# Altium project ePaper_Display.PrjPcb
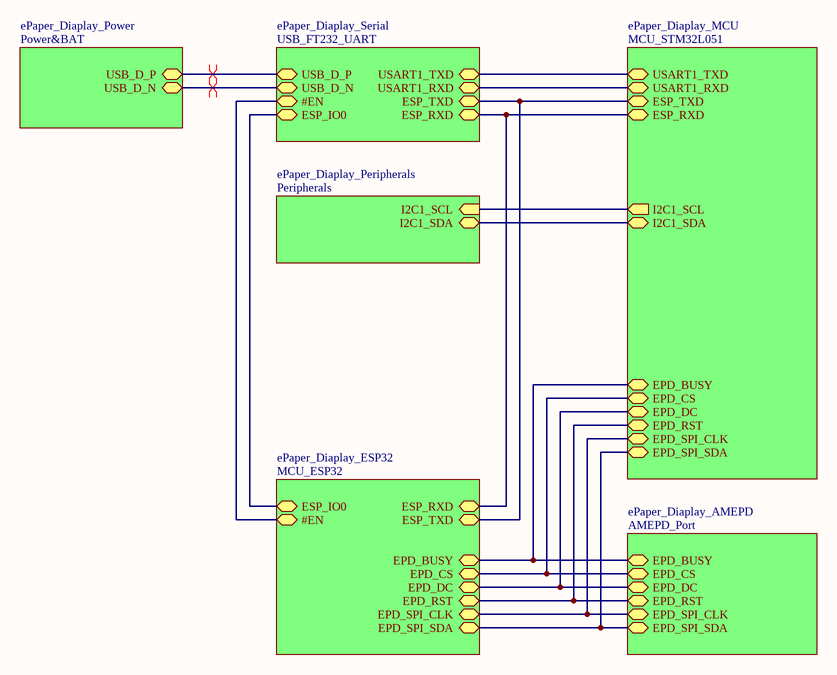
[diagram p0: ePaper_Display_Top.SchDoc]
7 sheets, 123 parts. Net scope: hierarchical (ports join the sheet entries above them; power ports are global).
Board file: ePpaer_Display_V1.0.PcbDoc
Sheets:
  ePaper_Display_Top.SchDoc
    ePaper_Diaplay_Power = Power&BAT.SchDoc
    ePaper_Diaplay_MCU = MCU_STM32L051.SchDoc
    ePaper_Diaplay_Peripherals = Peripherals.SchDoc
    ePaper_Diaplay_Serial = USB_FT232_UART.SchDoc
    ePaper_Diaplay_ESP32 = MCU_ESP32.SchDoc
    ePaper_Diaplay_AMEPD = AMEPD_Port.SchDoc

## Sheet ePaper_Display_Top.SchDoc
size A4; SheetNumber: 1; SheetTotal: 7

### Sub-sheets
ePaper_Diaplay_AMEPD = AMEPD_Port: EPD_BUSY (bidir), EPD_CS (bidir), EPD_DC (bidir), EPD_RST (bidir), EPD_SPI_CLK (bidir), EPD_SPI_SDA (bidir)
ePaper_Diaplay_ESP32 = MCU_ESP32: #EN (bidir), ESP_IO0 (bidir), ESP_RXD (bidir), ESP_TXD (bidir), EPD_SPI_SDA (bidir), EPD_SPI_CLK (bidir), EPD_RST (bidir), EPD_DC (bidir), EPD_CS (bidir), EPD_BUSY (bidir)
ePaper_Diaplay_MCU = MCU_STM32L051: I2C1_SCL (out), I2C1_SDA (bidir), USART1_TXD (bidir), USART1_RXD (bidir), ESP_TXD (bidir), ESP_RXD (bidir), EPD_DC (bidir), EPD_BUSY (bidir), EPD_CS (bidir), EPD_RST (bidir), EPD_SPI_CLK (bidir), EPD_SPI_SDA (bidir)
ePaper_Diaplay_Peripherals = Peripherals: I2C1_SDA (bidir), I2C1_SCL (in)
ePaper_Diaplay_Power = Power&BAT: USB_D_P (bidir), USB_D_N (bidir)
ePaper_Diaplay_Serial = USB_FT232_UART: USB_D_N (bidir), USB_D_P (bidir), USART1_RXD (bidir), USART1_TXD (bidir), #EN (bidir), ESP_IO0 (bidir), ESP_TXD (bidir), ESP_RXD (bidir)

### Nets
#EN: sheet ePaper_Diaplay_Serial/#EN, sheet ePaper_Diaplay_ESP32/#EN
EPD_BUSY: sheet ePaper_Diaplay_MCU/EPD_BUSY, sheet ePaper_Diaplay_ESP32/EPD_BUSY, sheet ePaper_Diaplay_AMEPD/EPD_BUSY
EPD_CS: sheet ePaper_Diaplay_MCU/EPD_CS, sheet ePaper_Diaplay_ESP32/EPD_CS, sheet ePaper_Diaplay_AMEPD/EPD_CS
EPD_DC: sheet ePaper_Diaplay_MCU/EPD_DC, sheet ePaper_Diaplay_ESP32/EPD_DC, sheet ePaper_Diaplay_AMEPD/EPD_DC
EPD_RST: sheet ePaper_Diaplay_MCU/EPD_RST, sheet ePaper_Diaplay_ESP32/EPD_RST, sheet ePaper_Diaplay_AMEPD/EPD_RST
EPD_SPI_CLK: sheet ePaper_Diaplay_MCU/EPD_SPI_CLK, sheet ePaper_Diaplay_ESP32/EPD_SPI_CLK, sheet ePaper_Diaplay_AMEPD/EPD_SPI_CLK
EPD_SPI_SDA: sheet ePaper_Diaplay_MCU/EPD_SPI_SDA, sheet ePaper_Diaplay_ESP32/EPD_SPI_SDA, sheet ePaper_Diaplay_AMEPD/EPD_SPI_SDA
ESP_IO0: sheet ePaper_Diaplay_Serial/ESP_IO0, sheet ePaper_Diaplay_ESP32/ESP_IO0
ESP_RXD: sheet ePaper_Diaplay_MCU/ESP_RXD, sheet ePaper_Diaplay_Serial/ESP_RXD, sheet ePaper_Diaplay_ESP32/ESP_RXD
ESP_TXD: sheet ePaper_Diaplay_MCU/ESP_TXD, sheet ePaper_Diaplay_Serial/ESP_TXD, sheet ePaper_Diaplay_ESP32/ESP_TXD
I2C1_SCL: sheet ePaper_Diaplay_MCU/I2C1_SCL, sheet ePaper_Diaplay_Peripherals/I2C1_SCL
I2C1_SDA: sheet ePaper_Diaplay_MCU/I2C1_SDA, sheet ePaper_Diaplay_Peripherals/I2C1_SDA
USART1_RXD: sheet ePaper_Diaplay_MCU/USART1_RXD, sheet ePaper_Diaplay_Serial/USART1_RXD
USART1_TXD: sheet ePaper_Diaplay_MCU/USART1_TXD, sheet ePaper_Diaplay_Serial/USART1_TXD
USB_D_N: sheet ePaper_Diaplay_Power/USB_D_N, sheet ePaper_Diaplay_Serial/USB_D_N
USB_D_P: sheet ePaper_Diaplay_Power/USB_D_P, sheet ePaper_Diaplay_Serial/USB_D_P

### Layout directives
differential pair: USB_D_N, USB_D_P

### Notes on the sheet
- Date:
- Size:
- Project Title:
- A4
- Revision:
- Sheet:
- of:
- File:
- Author:
- Chenhui Zhao

## Sheet Power&BAT.SchDoc
size A4; SheetNumber: 2; SheetTotal: 6
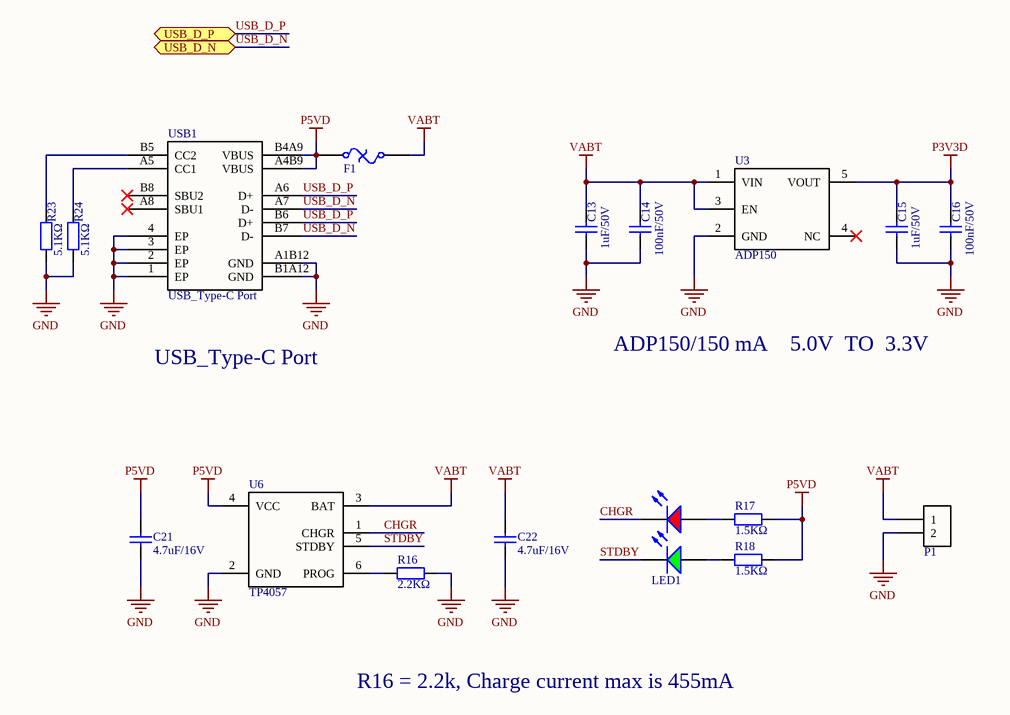
[diagram p1: Power&BAT.SchDoc]

### Parts
C13  1uF/50V  [0603_C]
C14  100nF/50V  [0603_C]
C15  1uF/50V  [0603_C]
C16  100nF/50V  [0603_C]
C21  4.7uF/16V  [0603_C]
C22  4.7uF/16V  [0603_C]
F1  500mA  [F1206]  (value not drawn)
LED1  LTST-C195TGKRKT  [LED_SMD]  (value not drawn)
P1  Header 2  [1.25_SMD]  (value not drawn)
R16  2.2KΩ  [0402_R]
R17  1.5KΩ  [0402_R]
R18  1.5KΩ  [0402_R]
R23  5.1KΩ  [0402_R]
R24  5.1KΩ  [0402_R]
U3  ADP150  [SOT23-5]
U6  TP4057  [SOT23-6]
USB1  USB_Type-C Port  [USB Type C Port (SMD)_16Pin]

### Ports
USB_D_N (bidir), USB_D_P (bidir)

### Nets
GND: C13.1 C14.1 C15.1 C16.1 C21.1 C22.1 P1.2 R16.2 R23.1 R24.1 U3.2(GND) U6.2(GND) USB1.1(EP) USB1.2(EP) USB1.3(EP) USB1.4(EP) USB1.A1B12(GND) USB1.B1A12(GND)
P3V3D: C15.2 C16.2 U3.5(VOUT)
P5VD: C21.2 F1.1 R17.2 R18.2 U6.4(VCC) USB1.A4B9(VBUS) USB1.B4A9(VBUS)
VABT: C13.2 C14.2 C22.2 F1.2 P1.1 U3.1(VIN) U3.3(EN) U6.3(BAT)
CHGR: LED1.4 U6.1(CHGR)
STDBY: LED1.3 U6.5(STDBY)
USB_D_N: USB1.A7(D-) USB1.B7(D-) ; port USB_D_N
USB_D_P: USB1.A6(D+) USB1.B6(D+) ; port USB_D_P
NetLED1_1: LED1.1 R18.1
NetLED1_2: LED1.2 R17.1
NetR16_1: R16.1 U6.6(PROG)
NetR23_2: R23.2 USB1.B5(CC2)
NetR24_2: R24.2 USB1.A5(CC1)

Not connected (* = marked no-connect by the designer): U3 4(NC)*; USB1 A8(SBU1)* B8(SBU2)*

### Notes on the sheet
- USB_Type-C Port
- ADP150/150 mA    5.0V  TO  3.3V
- R16 = 2.2k, Charge current max is 455mA
- Date:
- Size:
- Project Title:
- A4
- Revision:
- Sheet:
- of:
- File:
- Author:
- Chenhui Zhao

### Library data of the parts
C13 C15 = 0603 1uF (105) 10% 50V: 贴片电容; ComponentLink1Description: 供应商链接; ComponentLink1URL: http://www.szlcsc.com/product/details_16531.html; Package: 0603; Supplier: LC; SuppliersPartNumber: C15849
C14 C16 = 0603 100nF (104) 10% 50V: 贴片电容; ComponentLink1Description: 供应商链接; ComponentLink1URL: http://www.szlcsc.com/product/details_15331.html; Package: 0603; Supplier: LC; SuppliersPartNumber: C14663
C21 C22 = 0603 4.7uF (475) 10% 16V: 贴片电容; ComponentLink1Description: 供应商链接; ComponentLink1URL: http://www.szlcsc.com/product/details_20375.html; Package: 0603; Supplier: LC; SuppliersPartNumber: C19666
F1 = Fuse
LED1 = LED_SMD
P1 = Header 2: Header, 2-Pin
R16 = 0402 2.2KΩ (2201) 1%: 贴片电阻; ComponentLink1Description: 供应商链接; ComponentLink1URL: http://www.szlcsc.com/product/details_26622.html; Package: 0402; Supplier: LC; SuppliersPartNumber: C25879
R17 R18 = 0402 1.5KΩ (1501) 1%: 贴片电阻; ComponentLink1Description: 供应商链接; ComponentLink1URL: http://www.szlcsc.com/product/details_26610.html; Package: 0402; Supplier: LC; SuppliersPartNumber: C25867
R23 R24 = 0402 5.1KΩ (5101) 1%: 贴片电阻; ComponentLink1Description: 供应商链接; ComponentLink1URL: http://www.szlcsc.com/product/details_26648.html; Package: 0402; Supplier: LC; SuppliersPartNumber: C25905
U3 = ADP150: Ultralow Noise, 150 mA CMOS Linear Regulator
U6 = TP4057: 500mA线性锂离子电池充电器

## Sheet MCU_STM32L051.SchDoc
size A4; SheetNumber: 3; SheetTotal: 7
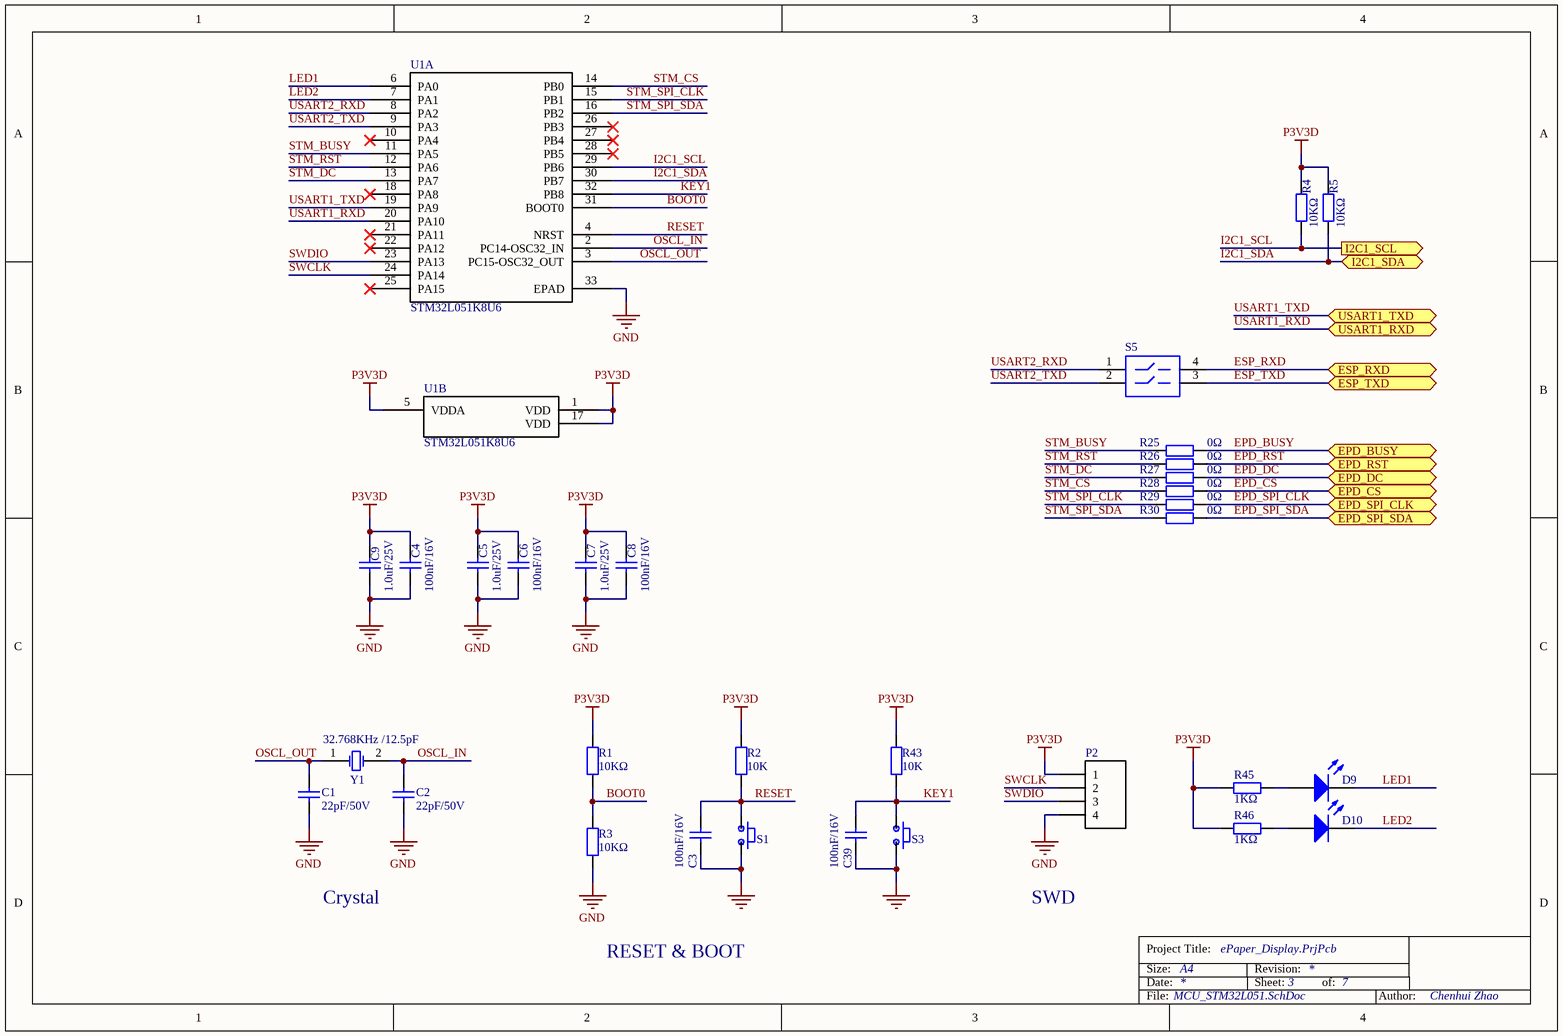
[diagram p2: MCU_STM32L051.SchDoc]

### Parts
C1  22pF/50V  [0402_C]
C2  22pF/50V  [0402_C]
C3  100nF/16V  [0402_C]
C4  100nF/16V  [0402_C]
C5  1.0uF/25V  [0402_C]
C6  100nF/16V  [0402_C]
C7  1.0uF/25V  [0402_C]
C8  100nF/16V  [0402_C]
C9  1.0uF/25V  [0402_C]
C39  100nF/16V  [0402_C]
D9  蓝灯 0603  [0603_LED_S1]  (value not drawn)
D10  蓝灯 0603  [0603_LED_S1]  (value not drawn)
P2  Header 4  [DIP4-2.00]  (value not drawn)
R1  10KΩ  [0402_R]
R2  10K  [0402_R]
R3  10KΩ  [0402_R]
R4  10KΩ  [0402_R]
R5  10KΩ  [0402_R]
R25  0Ω  [0402_R]
R26  0Ω  [0402_R]
R27  0Ω  [0402_R]
R28  0Ω  [0402_R]
R29  0Ω  [0402_R]
R30  0Ω  [0402_R]
R43  10K  [0402_R]
R45  1KΩ  [0402_R]
R46  1KΩ  [0402_R]
S1  Button  [SKRKAHE020]  (value not drawn)
S3  Button  [SKRKAHE020]  (value not drawn)
S5  拨码开关  [SW_SMT4]  (value not drawn)
U1  STM32L051K8U6  [UFQFPN32-5x5mm]  (parts A,B of 2)
Y1  32.768KHz /12.5pF  [SMD-3215_2P FC - 135]

### Ports
EPD_BUSY (bidir), EPD_CS (bidir), EPD_DC (bidir), EPD_RST (bidir), EPD_SPI_CLK (bidir), EPD_SPI_SDA (bidir), ESP_RXD (bidir), ESP_TXD (bidir), I2C1_SCL (out), I2C1_SDA (bidir), USART1_RXD (bidir), USART1_TXD (bidir)

### Nets
GND: C1.1 C2.1 C3.1 C4.1 C5.1 C6.1 C7.1 C8.1 C9.1 C39.1 P2.4 R3.1 S1.2 S3.2 U1.33(EPAD)
P3V3D: C4.2 C5.2 C6.2 C7.2 C8.2 C9.2 P2.1 R1.2 R2.2 R4.2 R5.2 R43.2 R45.2 R46.2 U1.1(VDD) U1.5(VDDA) U1.17(VDD)
BOOT0: R1.1 R3.2 U1.31(BOOT0)
EPD_BUSY: R25.2 ; port EPD_BUSY
EPD_CS: R28.2 ; port EPD_CS
EPD_DC: R27.2 ; port EPD_DC
EPD_RST: R26.2 ; port EPD_RST
EPD_SPI_CLK: R29.2 ; port EPD_SPI_CLK
EPD_SPI_SDA: R30.2 ; port EPD_SPI_SDA
ESP_RXD: S5.4 ; port ESP_RXD
ESP_TXD: S5.3 ; port ESP_TXD
I2C1_SCL: R4.1 U1.29(PB6) ; port I2C1_SCL
I2C1_SDA: R5.1 U1.30(PB7) ; port I2C1_SDA
KEY1: C39.2 R43.1 S3.1 U1.32(PB8)
LED1: D9.K U1.6(PA0)
LED2: D10.K U1.7(PA1)
OSCL_IN: C2.2 U1.2(PC14-OSC32_IN) Y1.2(OSC2)
OSCL_OUT: C1.2 U1.3(PC15-OSC32_OUT) Y1.1(OSC1)
RESET: C3.2 R2.1 S1.1 U1.4(NRST)
STM_BUSY: R25.1 U1.11(PA5)
STM_CS: R28.1 U1.14(PB0)
STM_DC: R27.1 U1.13(PA7)
STM_RST: R26.1 U1.12(PA6)
STM_SPI_CLK: R29.1 U1.15(PB1)
STM_SPI_SDA: R30.1 U1.16(PB2)
SWCLK: P2.2 U1.24(PA14)
SWDIO: P2.3 U1.23(PA13)
USART1_RXD: U1.20(PA10) ; port USART1_RXD
USART1_TXD: U1.19(PA9) ; port USART1_TXD
USART2_RXD: S5.1 U1.8(PA2)
USART2_TXD: S5.2 U1.9(PA3)
NetD9_A: D9.A R45.1
NetD10_A: D10.A R46.1

Not connected (* = marked no-connect by the designer): U1 10(PA4)* 18(PA8)* 21(PA11)* 22(PA12)* 25(PA15)* 26(PB3)* 27(PB4)* 28(PB5)*

### Notes on the sheet
- Crystal
- SWD
- RESET & BOOT
- Date:
- Size:
- Project Title:
- A4
- Revision:
- Sheet:
- of:
- File:
- Author:
- Chenhui Zhao

### Library data of the parts
C1 C2 = 0402 22pF (220) 5% 50V: 贴片电容; ComponentLink1Description: 供应商链接; ComponentLink1URL: http://www.szlcsc.com/product/details_1907.html; Package: 0402; Supplier: LC; SuppliersPartNumber: C1555
C3 C4 C6 C8 C39 = 0402 100nF (104) 10% 16V: 贴片电容; ComponentLink1Description: 供应商链接; ComponentLink1URL: http://www.szlcsc.com/product/details_1877.html; Package: 0402; Supplier: LC; SuppliersPartNumber: C1525
C5 C7 C9 = 0402 1.0uF (105) 10% 25V: 贴片电容; ComponentLink1Description: 供应商链接; ComponentLink1URL: http://www.szlcsc.com/product/details_53938.html; Package: 0402; Supplier: LC; SuppliersPartNumber: C52923
D9 D10 = 0603 蓝灯: 发光二极管; ComponentLink1Description: 供应商链接; ComponentLink1URL: http://www.szlcsc.com/product/details_73150.html; Package: 0603; Supplier: LC; SuppliersPartNumber: C72041
P2 = Header 4: Header, 4-Pin; LatestRevisionDate: 17-Jul-2002; LatestRevisionNote: Re-released for DXP Platform.; Publisher: Altium Limited
R1-R5 R43 = 0402 10KΩ (1002) 1%: 贴片电阻; ComponentLink1Description: 供应商链接; ComponentLink1URL: http://www.szlcsc.com/product/details_26487.html; Package: 0402; Supplier: LC; SuppliersPartNumber: C25744
R25-R30 = 0402 0Ω (0R0) 1%: 贴片电阻; ComponentLink1Description: 供应商链接; ComponentLink1URL: http://www.szlcsc.com/product/details_17853.html; Package: 0402; Supplier: LC; SuppliersPartNumber: C17168
R45 R46 = 0402 1KΩ (1001) 1%: 贴片电阻; ComponentLink1Description: 供应商链接; ComponentLink1URL: http://www.szlcsc.com/product/details_12256.html; Package: 0402; Supplier: LC; SuppliersPartNumber: C11702
S5 = SW-SMT2: SMT Switch, 4 Position, SPST
U1 = STM32L051K8U6: Ultra-low-power Arm Cortex-M0+ MCU with 64 Kbytes of Flash memory, 32 MHz CPU; Vendor: STMicroelectronics; Built_By: EMA_UL_Team; SourceLibrary: Updates_to_database_2020-10-19; Manufacturer_Part_Number: STM32L051K8U6; Copyright: Copyright (C) 2018 Accelerated Designs. All rights reserved; RefDes: RefDes; Type: DEV
Y1 = SMD-3215_2P 32.768KHz 20ppm 12.5pF: 贴片晶振; ComponentLink1Description: 供应商链接; ComponentLink1URL: http://www.szlcsc.com/product/details_33310.html; Package: SMD-3215_2P; Supplier: LC; SuppliersPartNumber: C32346

## Sheet Peripherals.SchDoc
size A4; SheetNumber: 4; SheetTotal: 7
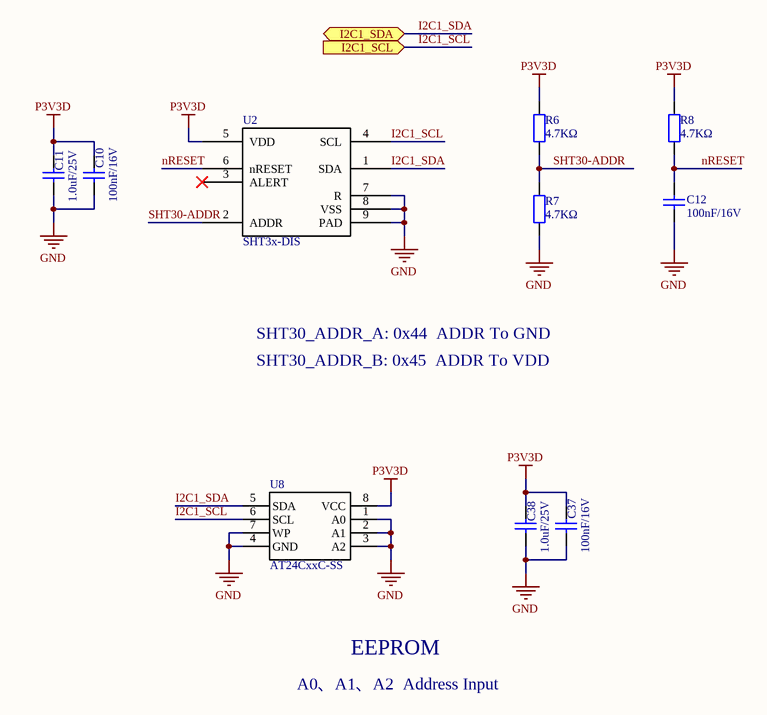
[diagram p3: Peripherals.SchDoc]

### Parts
C10  100nF/16V  [0402_C]
C11  1.0uF/25V  [0402_C]
C12  100nF/16V  [0402_C]
C37  100nF/16V  [0402_C]
C38  1.0uF/25V  [0402_C]
R6  4.7KΩ  [0402_R]
R7  4.7KΩ  [0402_R]
R8  4.7KΩ  [0402_R]
U2  SHT3x-DIS  [SHT3x-DIS_SEN]
U8  AT24CxxC-SS  [SOIC-8-39mm]

### Ports
I2C1_SCL (in), I2C1_SDA (bidir)

### Nets
GND: C10.1 C11.1 C12.1 C37.1 C38.1 R7.1 U2.7(R) U2.8(VSS) U2.9(PAD) U8.1(A0) U8.2(A1) U8.3(A2) U8.4(GND) U8.7(WP)
P3V3D: C10.2 C11.2 C37.2 C38.2 R6.2 R8.2 U2.5(VDD) U8.8(VCC)
I2C1_SCL: U2.4(SCL) U8.6(SCL) ; port I2C1_SCL
I2C1_SDA: U2.1(SDA) U8.5(SDA) ; port I2C1_SDA
nRESET: C12.2 R8.1 U2.6(nRESET)
SHT30-ADDR: R6.1 R7.2 U2.2(ADDR)

Not connected (* = marked no-connect by the designer): U2 3(ALERT)*

### Notes on the sheet
- SHT30_ADDR_A: 0x44  ADDR To GND
- SHT30_ADDR_B: 0x45  ADDR To VDD
- A0、A1、A2  Address Input
- EEPROM
- Date:
- Size:
- Project Title:
- A4
- Revision:
- Sheet:
- of:
- File:
- Author:
- Chenhui Zhao

### Library data of the parts
C10 C12 C37 = 0402 100nF (104) 10% 16V: 贴片电容; ComponentLink1Description: 供应商链接; ComponentLink1URL: http://www.szlcsc.com/product/details_1877.html; Package: 0402; Supplier: LC; SuppliersPartNumber: C1525
C11 C38 = 0402 1.0uF (105) 10% 25V: 贴片电容; ComponentLink1Description: 供应商链接; ComponentLink1URL: http://www.szlcsc.com/product/details_53938.html; Package: 0402; Supplier: LC; SuppliersPartNumber: C52923
R6-R8 = 0402 4.7KΩ (4701) 1%: 贴片电阻; ComponentLink1Description: 供应商链接; ComponentLink1URL: http://www.szlcsc.com/product/details_26643.html; Package: 0402; Supplier: LC; SuppliersPartNumber: C25900
U2 = SHT3x-DIS: Humidity and Temperature Sensor; Manufacturer_Part_Number: SHT30-DIS-F2.5KS; Vendor: Sensirion; Built_By: EMA_Cory; SourceLibrary: Sensirion_2020-07-31; Datasheet: https://media.digikey.com/pdf/Data%20Sheets/Sensirion%20PDFs/HT_DS_SHT3x_DIS.pdf; Copyright: Copyright (C) 2018 Accelerated Designs. All rights reserved; RefDes: RefDes; Type: DEV
U8 = AT24CxxC-SS: Serial EEPROM

## Sheet USB_FT232_UART.SchDoc
size A4; SheetNumber: 5; SheetTotal: 7
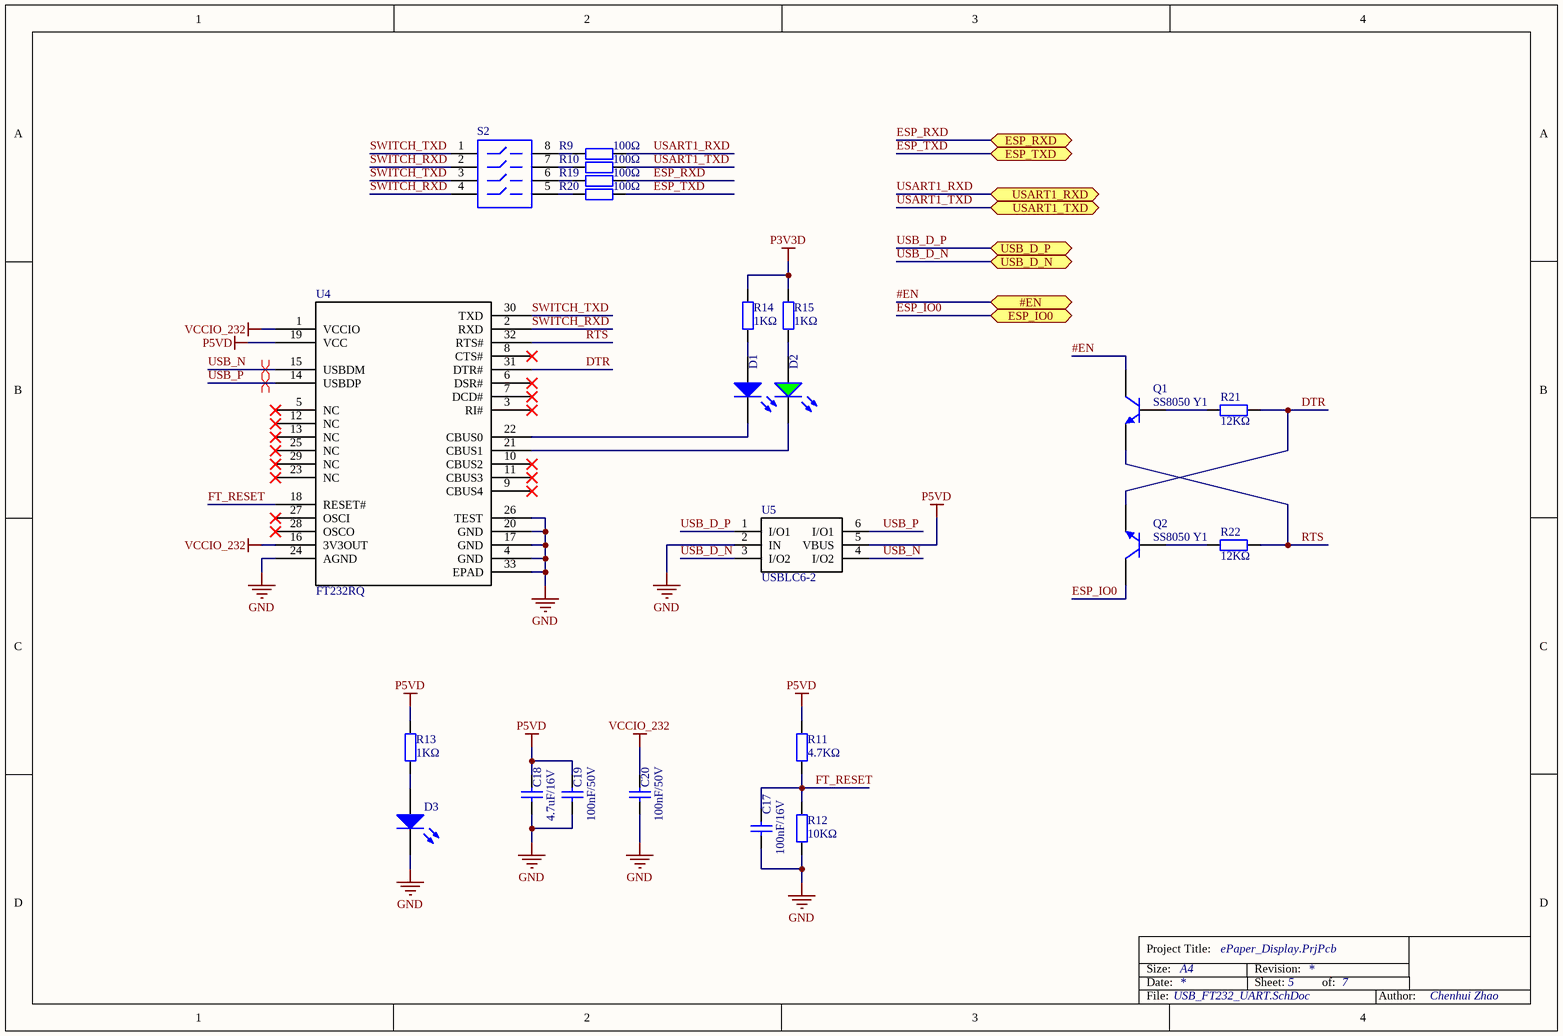
[diagram p4: USB_FT232_UART.SchDoc]

### Parts
C17  100nF/16V  [0402_C]
C18  4.7uF/16V  [0603_C]
C19  100nF/50V  [0603_C]
C20  100nF/50V  [0603_C]
D1  蓝灯 0603  [0603_LED_S1]  (value not drawn)
D2  绿灯 0603  [0603_LED_S1]  (value not drawn)
D3  蓝灯 0603  [0603_LED_S1]  (value not drawn)
Q1  SS8050 Y1  [SOT-23(SOT-23-3)]
Q2  SS8050 Y1  [SOT-23(SOT-23-3)]
R9  100Ω  [0402_R]
R10  100Ω  [0402_R]
R11  4.7KΩ  [0402_R]
R12  10KΩ  [0402_R]
R13  1KΩ  [0402_R]
R14  1KΩ  [0402_R]
R15  1KΩ  [0402_R]
R19  100Ω  [0402_R]
R20  100Ω  [0402_R]
R21  12KΩ  [0402_R]
R22  12KΩ  [0402_R]
S2  拨码开关  [SW_SMT8]  (value not drawn)
U4  FT232RQ  [QFN-32]
U5  USBLC6-2  [SOT23-6]

### Ports
#EN (bidir), ESP_IO0 (bidir), ESP_RXD (bidir), ESP_TXD (bidir), USART1_RXD (bidir), USART1_TXD (bidir), USB_D_N (bidir), USB_D_P (bidir)

### Nets
GND: C17.1 C18.1 C19.1 C20.1 D3.K R12.1 U4.4(GND) U4.17(GND) U4.20(GND) U4.24(AGND) U4.26(TEST) U4.33(EPAD) U5.2(IN)
P3V3D: R14.2 R15.2
P5VD: C18.2 C19.2 R11.2 R13.2 U4.19(VCC) U5.5(VBUS)
VCCIO_232: C20.2 U4.1(VCCIO) U4.16(3V3OUT)
#EN: Q1.3(C) ; port #EN
DTR: Q2.2(E) R21.2 U4.31(DTR#)
ESP_IO0: Q2.3(C) ; port ESP_IO0
ESP_RXD: R19.2 ; port ESP_RXD
ESP_TXD: R20.2 ; port ESP_TXD
FT_RESET: C17.2 R11.1 R12.2 U4.18(RESET#)
RTS: Q1.2(E) R22.2 U4.32(RTS#)
SWITCH_RXD: S2.2 S2.4 U4.2(RXD)
SWITCH_TXD: S2.1 S2.3 U4.30(TXD)
USART1_RXD: R9.2 ; port USART1_RXD
USART1_TXD: R10.2 ; port USART1_TXD
USB_D_N: U5.3(I/O2) ; port USB_D_N
USB_D_P: U5.1(I/O1) ; port USB_D_P
USB_N: U4.15(USBDM) U5.4(I/O2)
USB_P: U4.14(USBDP) U5.6(I/O1)
NetD1_A: D1.A R14.1
NetD1_K: D1.K U4.22(CBUS0)
NetD2_A: D2.A R15.1
NetD2_K: D2.K U4.21(CBUS1)
NetD3_A: D3.A R13.1
NetQ1_1: Q1.1(B) R21.1
NetQ2_1: Q2.1(B) R22.1
NetR9_1: R9.1 S2.8
NetR10_1: R10.1 S2.7
NetR19_1: R19.1 S2.6
NetR20_1: R20.1 S2.5

Not connected (* = marked no-connect by the designer): U4 3(RI#)* 5(NC)* 6(DSR#)* 7(DCD#)* 8(CTS#)* 9(CBUS4)* 10(CBUS2)* 11(CBUS3)* 12(NC)* 13(NC)* 23(NC)* 25(NC)* 27(OSCI)* 28(OSCO)* 29(NC)*

### Layout directives
differential pair: USB_N, USB_P

### Notes on the sheet
- Date:
- Size:
- Project Title:
- A4
- Revision:
- Sheet:
- of:
- File:
- Author:
- Chenhui Zhao

### Library data of the parts
C17 = 0402 100nF (104) 10% 16V: 贴片电容; ComponentLink1Description: 供应商链接; ComponentLink1URL: http://www.szlcsc.com/product/details_1877.html; Package: 0402; Supplier: LC; SuppliersPartNumber: C1525
C18 = 0603 4.7uF (475) 10% 16V: 贴片电容; ComponentLink1Description: 供应商链接; ComponentLink1URL: http://www.szlcsc.com/product/details_20375.html; Package: 0603; Supplier: LC; SuppliersPartNumber: C19666
C19 C20 = 0603 100nF (104) 10% 50V: 贴片电容; ComponentLink1Description: 供应商链接; ComponentLink1URL: http://www.szlcsc.com/product/details_15331.html; Package: 0603; Supplier: LC; SuppliersPartNumber: C14663
D1 D3 = 0603 蓝灯: 发光二极管; ComponentLink1Description: 供应商链接; ComponentLink1URL: http://www.szlcsc.com/product/details_73150.html; Package: 0603; Supplier: LC; SuppliersPartNumber: C72041
D2 = 0603 绿灯: 发光二极管; ComponentLink1Description: 供应商链接; ComponentLink1URL: http://www.szlcsc.com/product/details_73152.html; Package: 0603; Supplier: LC; SuppliersPartNumber: C72043
Q1 Q2 = SOT-23 SS8050 Y1: 三极管; ComponentLink1Description: 供应商链接; ComponentLink1URL: http://www.szlcsc.com/product/details_2507.html; Package: SOT-23; Supplier: LC; SuppliersPartNumber: C2150
R9 R10 R19 R20 = 0402 100Ω (1000) 1%: 贴片电阻; ComponentLink1Description: 供应商链接; ComponentLink1URL: http://www.szlcsc.com/product/details_25819.html; Package: 0402; Supplier: LC; SuppliersPartNumber: C25076
R11 = 0402 4.7KΩ (4701) 1%: 贴片电阻; ComponentLink1Description: 供应商链接; ComponentLink1URL: http://www.szlcsc.com/product/details_26643.html; Package: 0402; Supplier: LC; SuppliersPartNumber: C25900
R12 = 0402 10KΩ (1002) 1%: 贴片电阻; ComponentLink1Description: 供应商链接; ComponentLink1URL: http://www.szlcsc.com/product/details_26487.html; Package: 0402; Supplier: LC; SuppliersPartNumber: C25744
R13-R15 = 0402 1KΩ (1001) 1%: 贴片电阻; ComponentLink1Description: 供应商链接; ComponentLink1URL: http://www.szlcsc.com/product/details_12256.html; Package: 0402; Supplier: LC; SuppliersPartNumber: C11702
R21 R22 = 0402 12KΩ (1202) 1%: 贴片电阻; ComponentLink1Description: 供应商链接; ComponentLink1URL: http://www.szlcsc.com/product/details_26495.html; Package: 0402; Supplier: LC; SuppliersPartNumber: C25752
S2 = SW-SMT4: SMT Switch, 4 Position, SPST
U4 = FT232RQ: USB to serial UART interface
U5 = USBLC6-2: Very low capacitance ESD protection

## Sheet MCU_ESP32.SchDoc
size A4; SheetNumber: 6; SheetTotal: 7
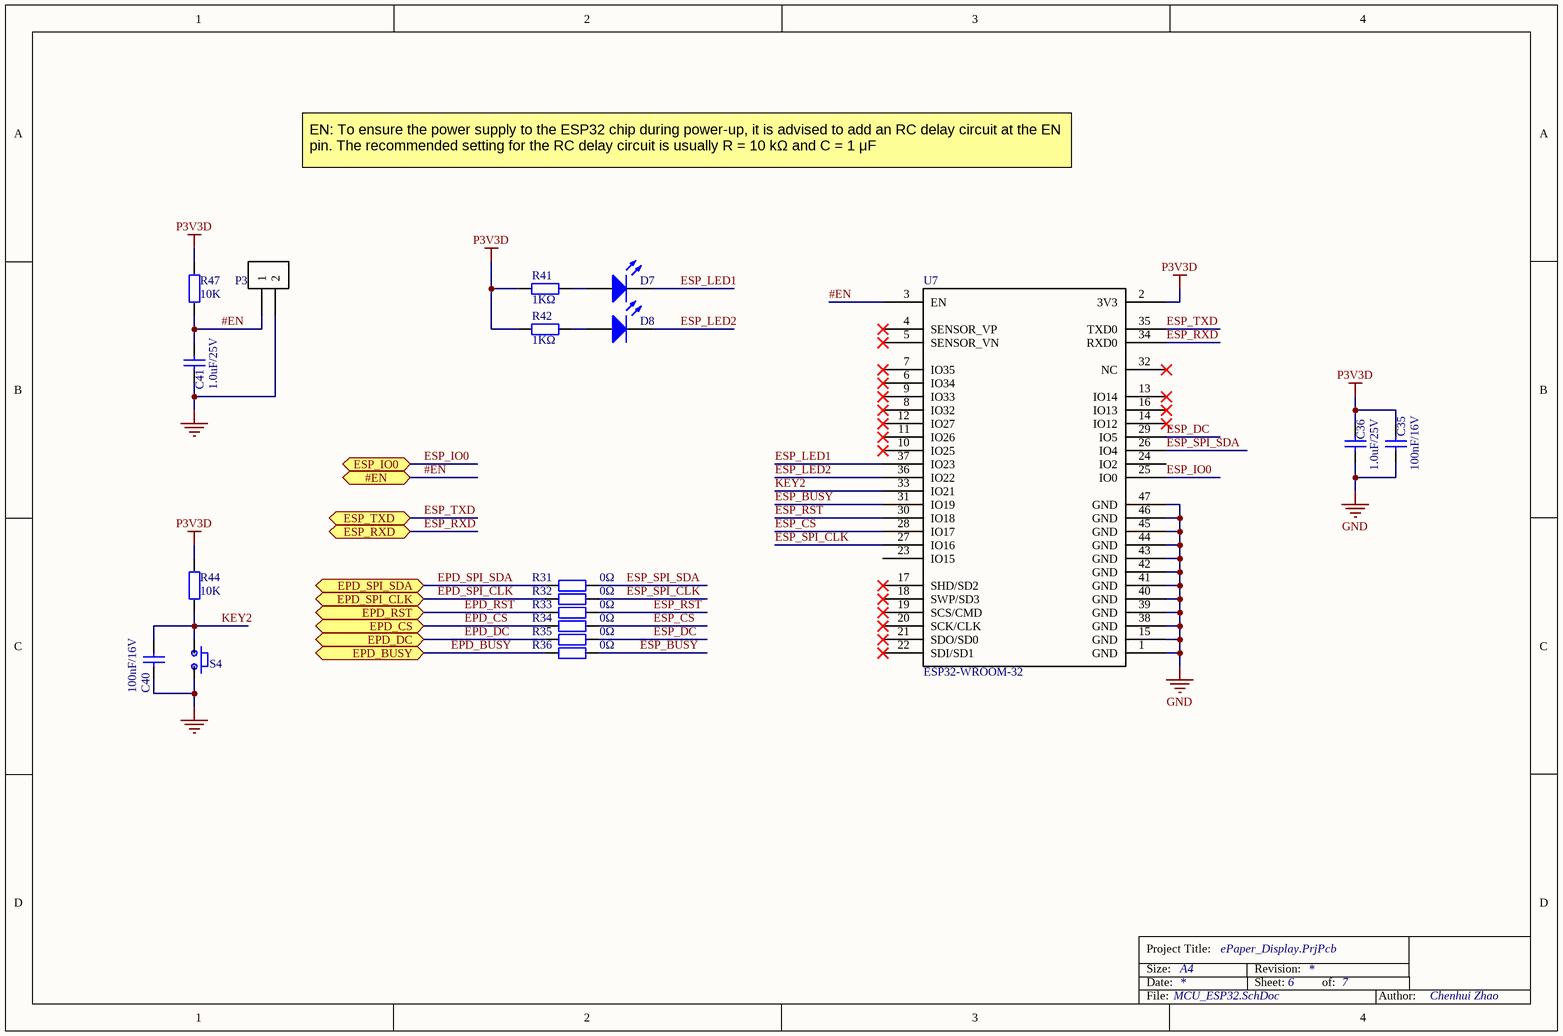
[diagram p5: MCU_ESP32.SchDoc]

### Parts
C35  100nF/16V  [0402_C]
C36  1.0uF/25V  [0402_C]
C40  100nF/16V  [0402_C]
C41  1.0uF/25V  [0402_C]
D7  蓝灯 0603  [0603_LED_S1]  (value not drawn)
D8  蓝灯 0603  [0603_LED_S1]  (value not drawn)
P3  Header 2  [DIP2_2.00]  (value not drawn)
R31  0Ω  [0402_R]
R32  0Ω  [0402_R]
R33  0Ω  [0402_R]
R34  0Ω  [0402_R]
R35  0Ω  [0402_R]
R36  0Ω  [0402_R]
R41  1KΩ  [0402_R]
R42  1KΩ  [0402_R]
R44  10K  [0402_R]
R47  10K  [0402_R]
S4  Button  [SKRKAHE020]  (value not drawn)
U7  ESP32-WROOM-32  [ESP32-WROOM-32]

### Ports
#EN (bidir), EPD_BUSY (bidir), EPD_CS (bidir), EPD_DC (bidir), EPD_RST (bidir), EPD_SPI_CLK (bidir), EPD_SPI_SDA (bidir), ESP_IO0 (bidir), ESP_RXD (bidir), ESP_TXD (bidir)

### Nets
GND: C35.1 C36.1 C40.1 C41.1 P3.2 S4.2 U7.1(GND) U7.15(GND) U7.38(GND) U7.39(GND) U7.40(GND) U7.41(GND) U7.42(GND) U7.43(GND) U7.44(GND) U7.45(GND) U7.46(GND) U7.47(GND)
P3V3D: C35.2 C36.2 R41.2 R42.2 R44.2 R47.2 U7.2(3V3)
#EN: C41.2 P3.1 R47.1 U7.3(EN) ; port #EN
EPD_BUSY: R36.1 ; port EPD_BUSY
EPD_CS: R34.1 ; port EPD_CS
EPD_DC: R35.1 ; port EPD_DC
EPD_RST: R33.1 ; port EPD_RST
EPD_SPI_CLK: R32.1 ; port EPD_SPI_CLK
EPD_SPI_SDA: R31.1 ; port EPD_SPI_SDA
ESP_BUSY: R36.2 U7.31(IO19)
ESP_CS: R34.2 U7.28(IO17)
ESP_DC: R35.2 U7.29(IO5)
ESP_IO0: U7.25(IO0) ; port ESP_IO0
ESP_LED1: D7.K U7.37(IO23)
ESP_LED2: D8.K U7.36(IO22)
ESP_RST: R33.2 U7.30(IO18)
ESP_RXD: U7.34(RXD0) ; port ESP_RXD
ESP_SPI_CLK: R32.2 U7.27(IO16)
ESP_SPI_SDA: R31.2 U7.26(IO4)
ESP_TXD: U7.35(TXD0) ; port ESP_TXD
KEY2: C40.2 R44.1 S4.1 U7.33(IO21)
NetD7_A: D7.A R41.1
NetD8_A: D8.A R42.1

Not connected (* = marked no-connect by the designer): U7 4(SENSOR_VP)* 5(SENSOR_VN)* 6(IO34)* 7(IO35)* 8(IO32)* 9(IO33)* 10(IO25)* 11(IO26)* 12(IO27)* 13(IO14)* 14(IO12)* 16(IO13)* 17(SHD/SD2)* 18(SWP/SD3)* 19(SCS/CMD)* 20(SCK/CLK)* 21(SDO/SD0)* 22(SDI/SD1)* 23(IO15) 24(IO2) 32(NC)*

### Notes on the sheet
- EN: To ensure the power supply to the ESP32 chip during power-up, it is advised to add an RC delay circuit at the EN pin. The recommended setting for the RC delay circuit is usually R = 10 kΩ and C = 1 μF
- Date:
- Size:
- Project Title:
- A4
- Revision:
- Sheet:
- of:
- File:
- Author:
- Chenhui Zhao

### Library data of the parts
C35 C40 = 0402 100nF (104) 10% 16V: 贴片电容; ComponentLink1Description: 供应商链接; ComponentLink1URL: http://www.szlcsc.com/product/details_1877.html; Package: 0402; Supplier: LC; SuppliersPartNumber: C1525
C36 C41 = 0402 1.0uF (105) 10% 25V: 贴片电容; ComponentLink1Description: 供应商链接; ComponentLink1URL: http://www.szlcsc.com/product/details_53938.html; Package: 0402; Supplier: LC; SuppliersPartNumber: C52923
D7 D8 = 0603 蓝灯: 发光二极管; ComponentLink1Description: 供应商链接; ComponentLink1URL: http://www.szlcsc.com/product/details_73150.html; Package: 0603; Supplier: LC; SuppliersPartNumber: C72041
P3 = Header 2: Header, 2-Pin
R31-R36 = 0402 0Ω (0R0) 1%: 贴片电阻; ComponentLink1Description: 供应商链接; ComponentLink1URL: http://www.szlcsc.com/product/details_17853.html; Package: 0402; Supplier: LC; SuppliersPartNumber: C17168
R41 R42 = 0402 1KΩ (1001) 1%: 贴片电阻; ComponentLink1Description: 供应商链接; ComponentLink1URL: http://www.szlcsc.com/product/details_12256.html; Package: 0402; Supplier: LC; SuppliersPartNumber: C11702
R44 R47 = 0402 10KΩ (1002) 1%: 贴片电阻; ComponentLink1Description: 供应商链接; ComponentLink1URL: http://www.szlcsc.com/product/details_26487.html; Package: 0402; Supplier: LC; SuppliersPartNumber: C25744
U7 = ESP32-WROOM-32: ESP32-WROOM-32D and ESP32-WROOM-32U are powerful, generic Wi-Fi+BT+BLE MCU modules that target a wide variety of applications, ranging from low-power sensor networks to the most demanding tasks,; Manufacturer_Part_Number: ESP32-WROOM-32UE (16MB); Vendor: Espressif Systems; Built_By: EMA_Kyle; SourceLibrary: Update_to_database_2021-06-03; Datasheet: https://www.espressif.com/sites/default/files/documentation/esp32-wroom-32e_esp32-wroom-32ue_datasheet_en.pdf; Copyright: Copyright (C) 2018 Accelerated Designs. All rights reserved; RefDes: RefDes; Type: DEV

## Sheet AMEPD_Port.SchDoc
size A4; SheetNumber: 7; SheetTotal: 7
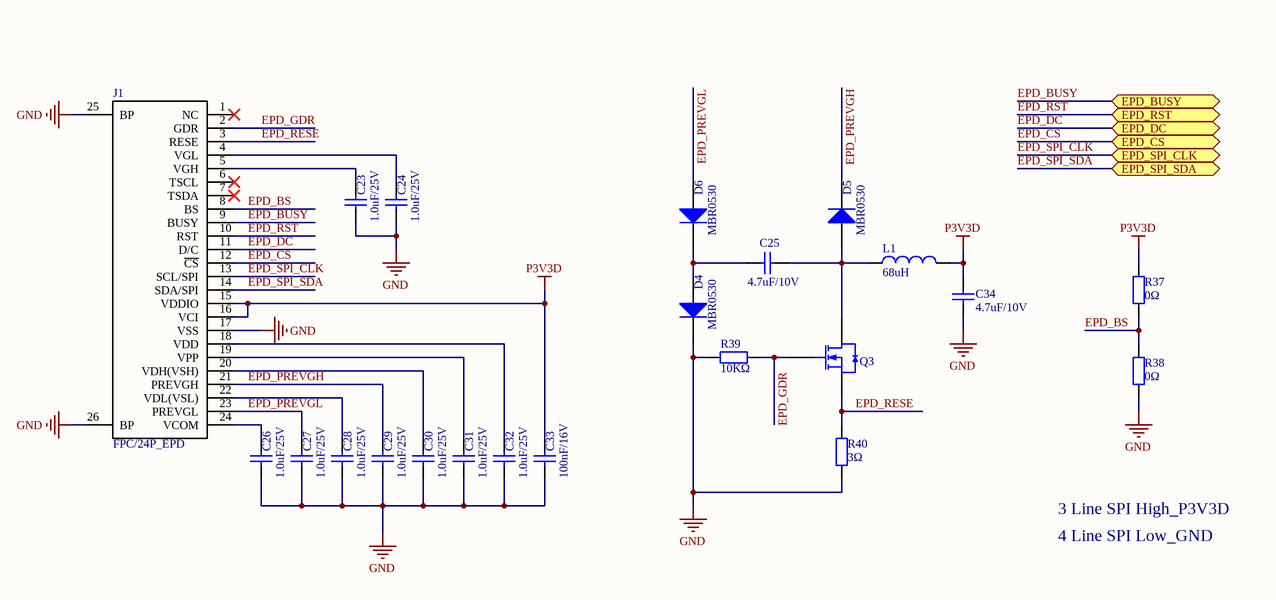
[diagram p6: AMEPD_Port.SchDoc]

### Parts
C23  1.0uF/25V  [0402_C]
C24  1.0uF/25V  [0402_C]
C25  4.7uF/10V  [0402_C]
C26  1.0uF/25V  [0402_C]
C27  1.0uF/25V  [0402_C]
C28  1.0uF/25V  [0402_C]
C29  1.0uF/25V  [0402_C]
C30  1.0uF/25V  [0402_C]
C31  1.0uF/25V  [0402_C]
C32  1.0uF/25V  [0402_C]
C33  100nF/16V  [0402_C]
C34  4.7uF/10V  [0402_C]
D4  MBR0530  [SOD-123]
D5  MBR0530  [SOD-123]
D6  MBR0530  [SOD-123]
J1  FPC/24P_EPD  [FPC/24P_EPD]
L1  68uH  [LSMD4X4]
Q3  AO3400A N道沟 X0YV1T SOT-23  [SOT-23-3L]  (value not drawn)
R37  0Ω  [0402_R]
R38  0Ω  [0402_R]
R39  10KΩ  [0402_R]
R40  3Ω  [0402_R]

### Ports
EPD_BUSY (bidir), EPD_CS (bidir), EPD_DC (bidir), EPD_RST (bidir), EPD_SPI_CLK (bidir), EPD_SPI_SDA (bidir)

### Nets
GND: C23.1 C24.1 C26.1 C27.1 C28.1 C29.1 C30.1 C31.1 C32.1 C33.2 C34.1 D4.2(K) J1.17(VSS) J1.25(BP) J1.26(BP) R38.1 R39.1 R40.1
P3V3D: C33.1 C34.2 J1.15(VDDIO) J1.16(VCI) L1.2 R37.2
EPD_BS: J1.8(BS) R37.1 R38.2
EPD_BUSY: J1.9(BUSY) ; port EPD_BUSY
EPD_CS: J1.12(~{CS}) ; port EPD_CS
EPD_DC: J1.11(D/C) ; port EPD_DC
EPD_GDR: J1.2(GDR) Q3.1(G) R39.2
EPD_PREVGH: C29.2 D5.2(K) J1.21(PREVGH)
EPD_PREVGL: C27.2 D6.1(A) J1.23(PREVGL)
EPD_RESE: J1.3(RESE) Q3.2(S) R40.2
EPD_RST: J1.10(RST) ; port EPD_RST
EPD_SPI_CLK: J1.13(SCL/SPI) ; port EPD_SPI_CLK
EPD_SPI_SDA: J1.14(SDA/SPI) ; port EPD_SPI_SDA
NetC23_2: C23.2 J1.5(VGH)
NetC24_2: C24.2 J1.4(VGL)
NetC25_1: C25.1 D4.1(A) D6.2(K)
NetC25_2: C25.2 D5.1(A) L1.1 Q3.3(D)
NetC26_2: C26.2 J1.24(VCOM)
NetC28_2: C28.2 J1.22(VDL(VSL))
NetC30_2: C30.2 J1.20(VDH(VSH))
NetC31_2: C31.2 J1.19(VPP)
NetC32_2: C32.2 J1.18(VDD)

Not connected (* = marked no-connect by the designer): J1 1(NC)* 6(TSCL)* 7(TSDA)*

### Notes on the sheet
- 3 Line SPI High_P3V3D
- 4 Line SPI Low_GND
- Date:
- Size:
- Project Title:
- A4
- Revision:
- Sheet:
- of:
- File:
- Author:
- Chenhui Zhao

### Library data of the parts
C23 C24 C26-C32 = 0402 1.0uF (105) 10% 25V: 贴片电容; ComponentLink1Description: 供应商链接; ComponentLink1URL: http://www.szlcsc.com/product/details_53938.html; Package: 0402; Supplier: LC; SuppliersPartNumber: C52923
C25 C34 = 0402 4.7uF (475) 20% 10V: 贴片电容; ComponentLink1Description: 供应商链接; ComponentLink1URL: http://www.szlcsc.com/product/details_24469.html; Package: 0402; Supplier: LC; SuppliersPartNumber: C23733
C33 = 0402 100nF (104) 10% 16V: 贴片电容; ComponentLink1Description: 供应商链接; ComponentLink1URL: http://www.szlcsc.com/product/details_1877.html; Package: 0402; Supplier: LC; SuppliersPartNumber: C1525
D4-D6 = SOD-123 B5819W  SL: 肖特基二极管; ComponentLink1Description: 供应商链接; ComponentLink1URL: http://www.szlcsc.com/product/details_9093.html; Package: SOD-123; Supplier: LC; SuppliersPartNumber: C8598
J1 = FPC/24P_EPD: Active Matrix Electrophoretic Display (AMEPD)
L1 = L: Inductor; Value: 10u
Q3 = AO3400A N道沟 X0YV1T SOT-23: MOS(场效应管); ComponentLink1Description: 供应商链接; ComponentLink1URL: http://www.szlcsc.com/product/details_21629.html; Package: SOT-23; Supplier: LC; SuppliersPartNumber: C20917
R37 R38 = 0402 0Ω (0R0) 1%: 贴片电阻; ComponentLink1Description: 供应商链接; ComponentLink1URL: http://www.szlcsc.com/product/details_17853.html; Package: 0402; Supplier: LC; SuppliersPartNumber: C17168
R39 = 0402 10KΩ (1002) 1%: 贴片电阻; ComponentLink1Description: 供应商链接; ComponentLink1URL: http://www.szlcsc.com/product/details_26487.html; Package: 0402; Supplier: LC; SuppliersPartNumber: C25744
R40 = 0402 33Ω (33R0) 1%: 贴片电阻; ComponentLink1Description: 供应商链接; ComponentLink1URL: http://www.szlcsc.com/product/details_25848.html; Package: 0402; Supplier: LC; SuppliersPartNumber: C25105

## Nets that join several sheets
GND: Power&BAT (18 pins), MCU_STM32L051 (15 pins), Peripherals (14 pins), USB_FT232_UART (13 pins), MCU_ESP32 (18 pins), AMEPD_Port (18 pins)
P3V3D: Power&BAT (C15.2 C16.2 U3.5), MCU_STM32L051 (17 pins), Peripherals (8 pins), USB_FT232_UART (R14.2 R15.2), MCU_ESP32 (7 pins), AMEPD_Port (6 pins)
P5VD: Power&BAT (7 pins), USB_FT232_UART (6 pins)
#EN: USB_FT232_UART (Q1.3), MCU_ESP32 (C41.2 P3.1 R47.1 U7.3)
EPD_BUSY: MCU_STM32L051 (R25.2), MCU_ESP32 (R36.1), AMEPD_Port (J1.9)
EPD_CS: MCU_STM32L051 (R28.2), MCU_ESP32 (R34.1), AMEPD_Port (J1.12)
EPD_DC: MCU_STM32L051 (R27.2), MCU_ESP32 (R35.1), AMEPD_Port (J1.11)
EPD_RST: MCU_STM32L051 (R26.2), MCU_ESP32 (R33.1), AMEPD_Port (J1.10)
EPD_SPI_CLK: MCU_STM32L051 (R29.2), MCU_ESP32 (R32.1), AMEPD_Port (J1.13)
EPD_SPI_SDA: MCU_STM32L051 (R30.2), MCU_ESP32 (R31.1), AMEPD_Port (J1.14)
ESP_IO0: USB_FT232_UART (Q2.3), MCU_ESP32 (U7.25)
ESP_RXD: MCU_STM32L051 (S5.4), USB_FT232_UART (R19.2), MCU_ESP32 (U7.34)
ESP_TXD: MCU_STM32L051 (S5.3), USB_FT232_UART (R20.2), MCU_ESP32 (U7.35)
I2C1_SCL: MCU_STM32L051 (R4.1 U1.29), Peripherals (U2.4 U8.6)
I2C1_SDA: MCU_STM32L051 (R5.1 U1.30), Peripherals (U2.1 U8.5)
USART1_RXD: MCU_STM32L051 (U1.20), USB_FT232_UART (R9.2)
USART1_TXD: MCU_STM32L051 (U1.19), USB_FT232_UART (R10.2)
USB_D_N: Power&BAT (USB1.A7 USB1.B7), USB_FT232_UART (U5.3)
USB_D_P: Power&BAT (USB1.A6 USB1.B6), USB_FT232_UART (U5.1)

## Assembly variants
Variant of ePaper_Display: not fitted J1 P1 P2 P3 R1 R6 R25 R26 R27 R28 R29 R30 R37